# EAGLE design interface_dac_sma_feedback_3PS_LM317_parallel (EAGLE 7.2.0)
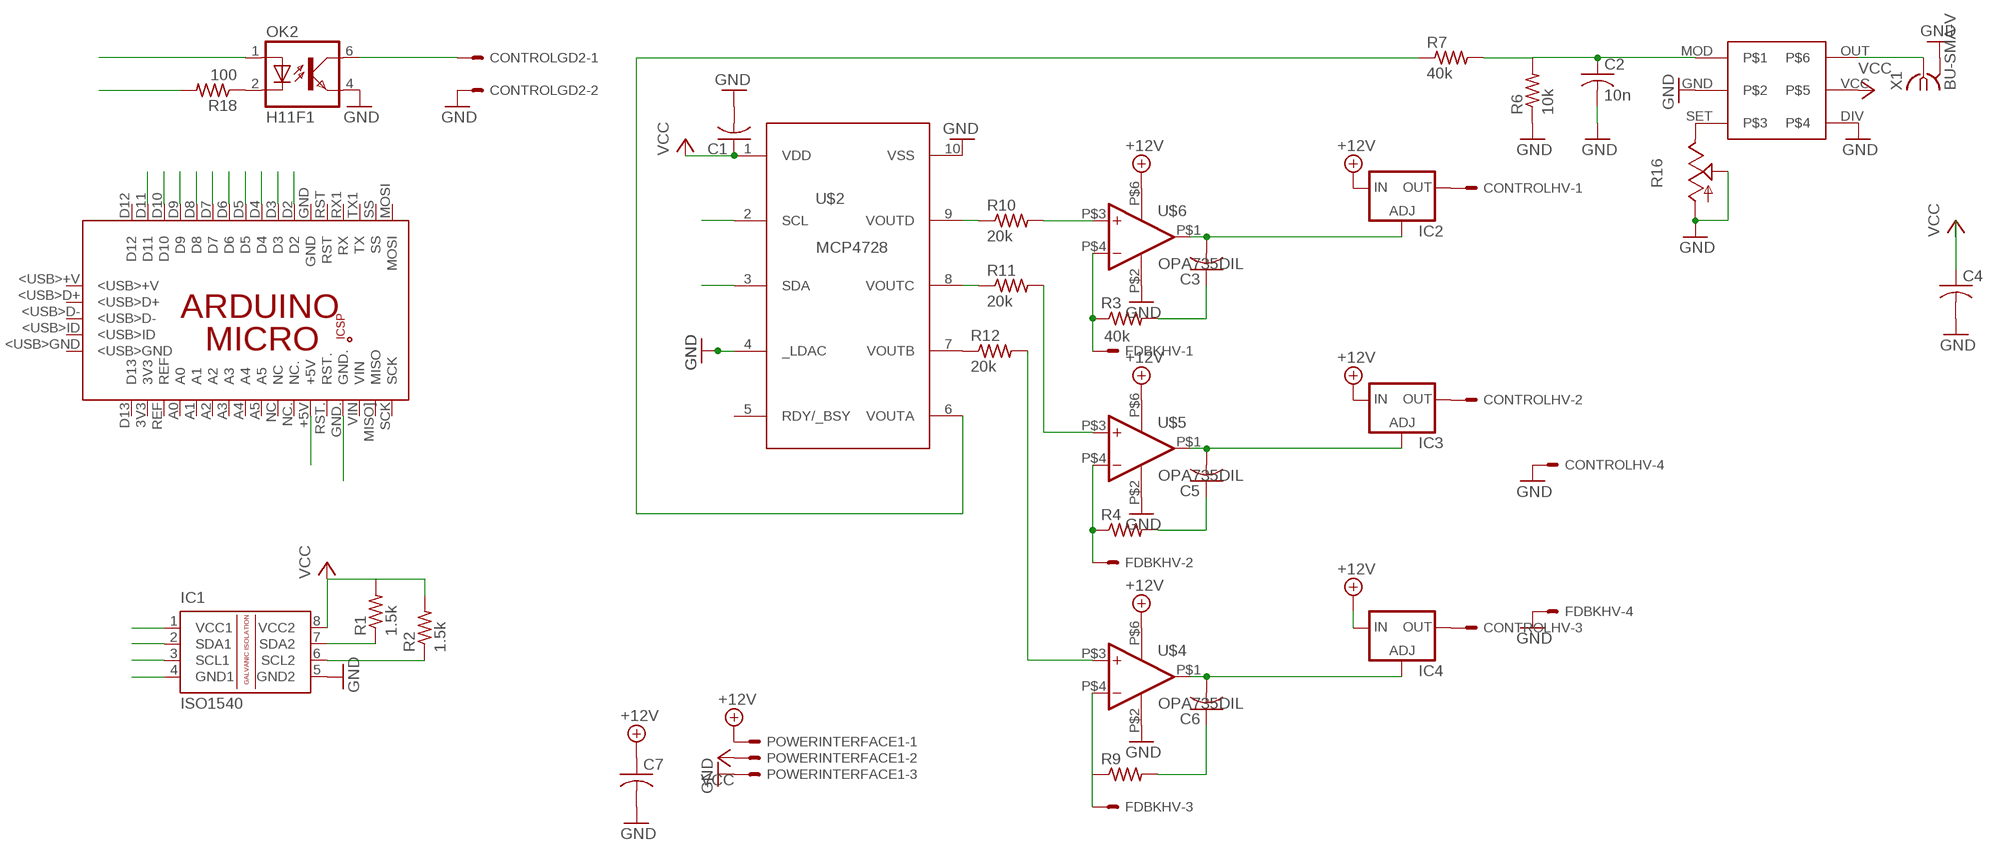
[diagram p0: schematic, sheet 1]

## Parts
C1  C-US050-050X075  [C050-050X075]
C2  10n  C-US050-024X044  [C050-024X044]
C3  C-US050-024X044  [C050-024X044]
C4  C-US075-063X106  [C075-063X106]
C5  C-US050-024X044  [C050-024X044]
C6  C-US050-024X044  [C050-024X044]
C7  C-US050-050X075  [C050-050X075]
CONTROLGD2  KK-156-2  [KK-156-2]
CONTROLHV  KK-156-4  [KK-156-4]
FDBKHV  40k  KK-156-4  [KK-156-4]
IC1  ISO1540  [DIL08]
IC2  LM317TS  [317TS]
IC3  LM317TS  [317TS]
IC4  LM317TS  [317TS]
OK2  H11F1  [DIL05]
PCB1  ARDUINO_MICRO  [ARDUINO_MICRO]
POWERINTERFACE1  KK-156-3  [KK-156-3]
R1  1.5k  R-US_0207/12  [0207/12]
R2  1.5k  R-US_0207/12  [0207/12]
R3  R-US_0207/12  [0207/12]
R4  R-US_0207/12  [0207/12]
R6  10k  R-US_0207/12  [0207/12]
R7  40k  R-US_0207/12  [0207/12]
R9  R-US_0207/12  [0207/12]
R10  20k  R-US_0207/12  [0207/12]
R11  20k  R-US_0207/12  [0207/12]
R12  20k  R-US_0207/12  [0207/12]
R16  TRIM_US-B90P  [SP19L]
R18  100  R-US_0207/12  [0207/12]
U$1  LTC6992  [DIL06]
U$2  MCP4728DIL  [DIL10]
U$4  OPA735DIL  [DIL6]
U$5  OPA735DIL  [DIL6]
U$6  OPA735DIL  [DIL6]
X1  BU-SMA-V  [BU-SMA-V]

## Nets
+12V: C7.1 IC2.3(IN) IC3.3(IN) IC4.3(IN) POWERINTERFACE1.1 U$4.P$6(V+) U$5.P$6(V+) U$6.P$6(V+)
A+5: IC1.1(VCC1) PCB1.+5V
AGND: IC1.4(GND1) PCB1.GND. R18.2
D4: PCB1.D4
D7: PCB1.D7
D8: PCB1.D8
D10: PCB1.D10
D11: PCB1.D11
ENSW2: CONTROLGD2.1 OK2.6(COL)
GND: C1.2 C2.2 C4.2 C7.2 CONTROLGD2.2 CONTROLHV.4 FDBKHV.4 IC1.5(GND2) OK2.4(EMIT) POWERINTERFACE1.3 R6.1 R16.A R16.S U$1.DIV U$1.GND U$2.4(_LDAC) U$2.10(VSS) U$4.P$2(V-) U$5.P$2(V-) U$6.P$2(V-) X1.2 X1.3 X1.4 X1.5
N$1: R7.1 U$2.6(VOUTA)
N$2: C2.1 R6.2 R7.2 U$1.MOD
N$3: C3.1 R3.2
N$4: CONTROLHV.1 IC2.2(OUT)
N$5: CONTROLHV.3 IC4.2(OUT)
N$6: FDBKHV.2 R4.1 U$5.P$4(-IN)
N$7: OK2.2(C) R18.1
N$8: FDBKHV.1 R3.1 U$6.P$4(-IN)
N$10: C5.2 IC3.1(ADJ) U$5.P$1(OUT)
N$11: CONTROLHV.2 IC3.2(OUT)
N$12: R16.E U$1.SET
N$13: U$1.OUT X1.1
N$14: FDBKHV.3 R9.1 U$4.P$4(-IN)
N$15: C5.1 R4.2
N$16: R10.2 U$6.P$3(+IN)
N$17: R11.2 U$5.P$3(+IN)
N$18: R12.2 U$4.P$3(+IN)
N$19: C3.2 IC2.1(ADJ) U$6.P$1(OUT)
N$20: C6.1 R9.2
N$21: C6.2 IC4.1(ADJ) U$4.P$1(OUT)
N$24: R10.1 U$2.9(VOUTD)
N$25: R12.1 U$2.7(VOUTB)
N$26: R11.1 U$2.8(VOUTC)
PWM5: PCB1.D5
PWM6: PCB1.D6
PWM9: OK2.1(A) PCB1.D9
SCL: IC1.3(SCL1) PCB1.D3
SCL_OUT: IC1.6(SCL2) R2.1 U$2.2(SCL)
SDA: IC1.2(SDA1) PCB1.D2
SDA_OUT: IC1.7(SDA2) R1.1 U$2.3(SDA)
VCC: C1.1 C4.1 IC1.8(VCC2) POWERINTERFACE1.2 R1.2 R2.2 U$1.VCC U$2.1(VDD)
Unconnected: PCB1.3V3 PCB1.5V PCB1.<USB>+V PCB1.<USB>D+ PCB1.<USB>D- PCB1.<USB>GND PCB1.<USB>ID PCB1.A0 PCB1.A1 PCB1.A2 PCB1.A3 PCB1.A4 PCB1.A5 PCB1.D12 PCB1.D13 PCB1.GND PCB1.GND_ PCB1.MISO. PCB1.MISO](MISO) PCB1.MOSI PCB1.MOSI. PCB1.NC PCB1.NC. PCB1.REF PCB1.RESET.. PCB1.RST PCB1.RST. PCB1.RX1(RX) PCB1.SCK PCB1.SCK. PCB1.SS PCB1.TX1(TX) PCB1.VIN U$2.5(RDY/_BSY)

## Library data of the parts
C1 = rcl:C-US: CAPACITOR, American symbol
C2-C7 = resistor:C-US: CAPACITOR, American symbol
CONTROLGD2 = con-molex:KK-156-2: KK 156 HEADER Source: http://www.molex.com/pdm_docs/sd/026604100_sd.pdf; OC_FARNELL: unknown; OC_NEWARK: unknown
CONTROLHV FDBKHV = con-molex:KK-156-4: KK 156 HEADER Source: http://www.molex.com/pdm_docs/sd/026604100_sd.pdf; OC_FARNELL: unknown; OC_NEWARK: unknown
IC1 = texas:ISO1540: ISOLATED CAN TRANSCEIVER Source: http://focus.ti.com/lit/ds/symlink/iso1050.pdf
IC2-IC4 = v-reg:LM317TS: VOLTAGE REGULATOR
OK2 = optocoupler:H11F1: OPTO COUPLER OPTO COUPLER; OC_FARNELL: unknown; OC_NEWARK: unknown
PCB1 = E14_Arduino_published:ARDUINO_MICRO: Device for representing an Arduino Micro board with a footprint in an EAGLE design. Created by Dave Young for Element14. More EAGLE documentation at: http://www.element14.com/community/community/knode/cadsoft_eagle
POWERINTERFACE1 = con-molex:KK-156-3: KK 156 HEADER Source: http://www.molex.com/pdm_docs/sd/026604100_sd.pdf; OC_FARNELL: unknown; OC_NEWARK: unknown
R1-R4 R6 R7 R9-R12 = resistor:R-US_: RESISTOR, American symbol
R16 = pot:TRIM_US-: POTENTIOMETER
R18 = rcl:R-US_: RESISTOR, American symbol
U$1 = linear-technology:LTC6992
U$2 = microchip:MCP4728
U$4-U$6 = texas:OPA735
X1 = con-coax:BU-SMA-V: FEMALE SMA CONNECTOR Radiall distributor RS 112-3794; OC_FARNELL: unknown; OC_NEWARK: unknown

## Board
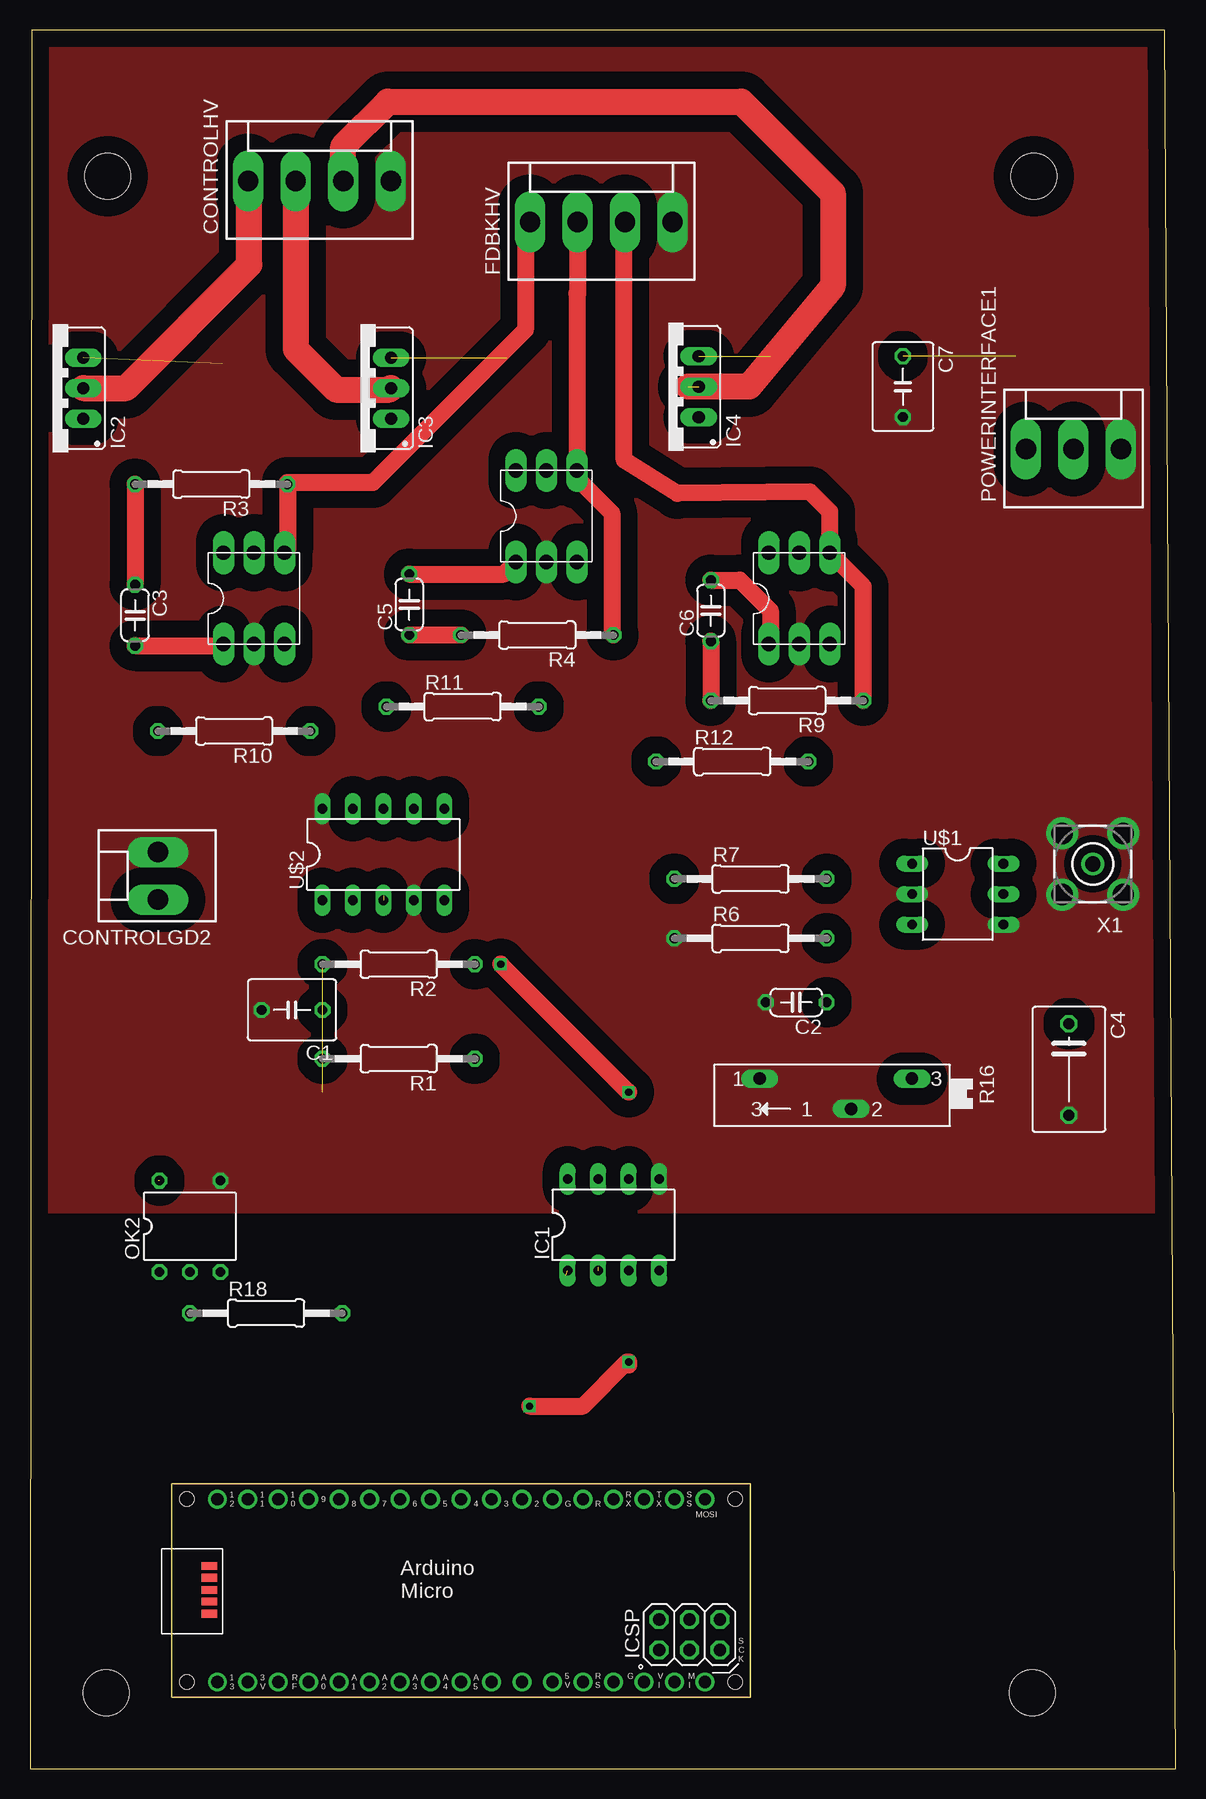
[diagram p1: board, top side]
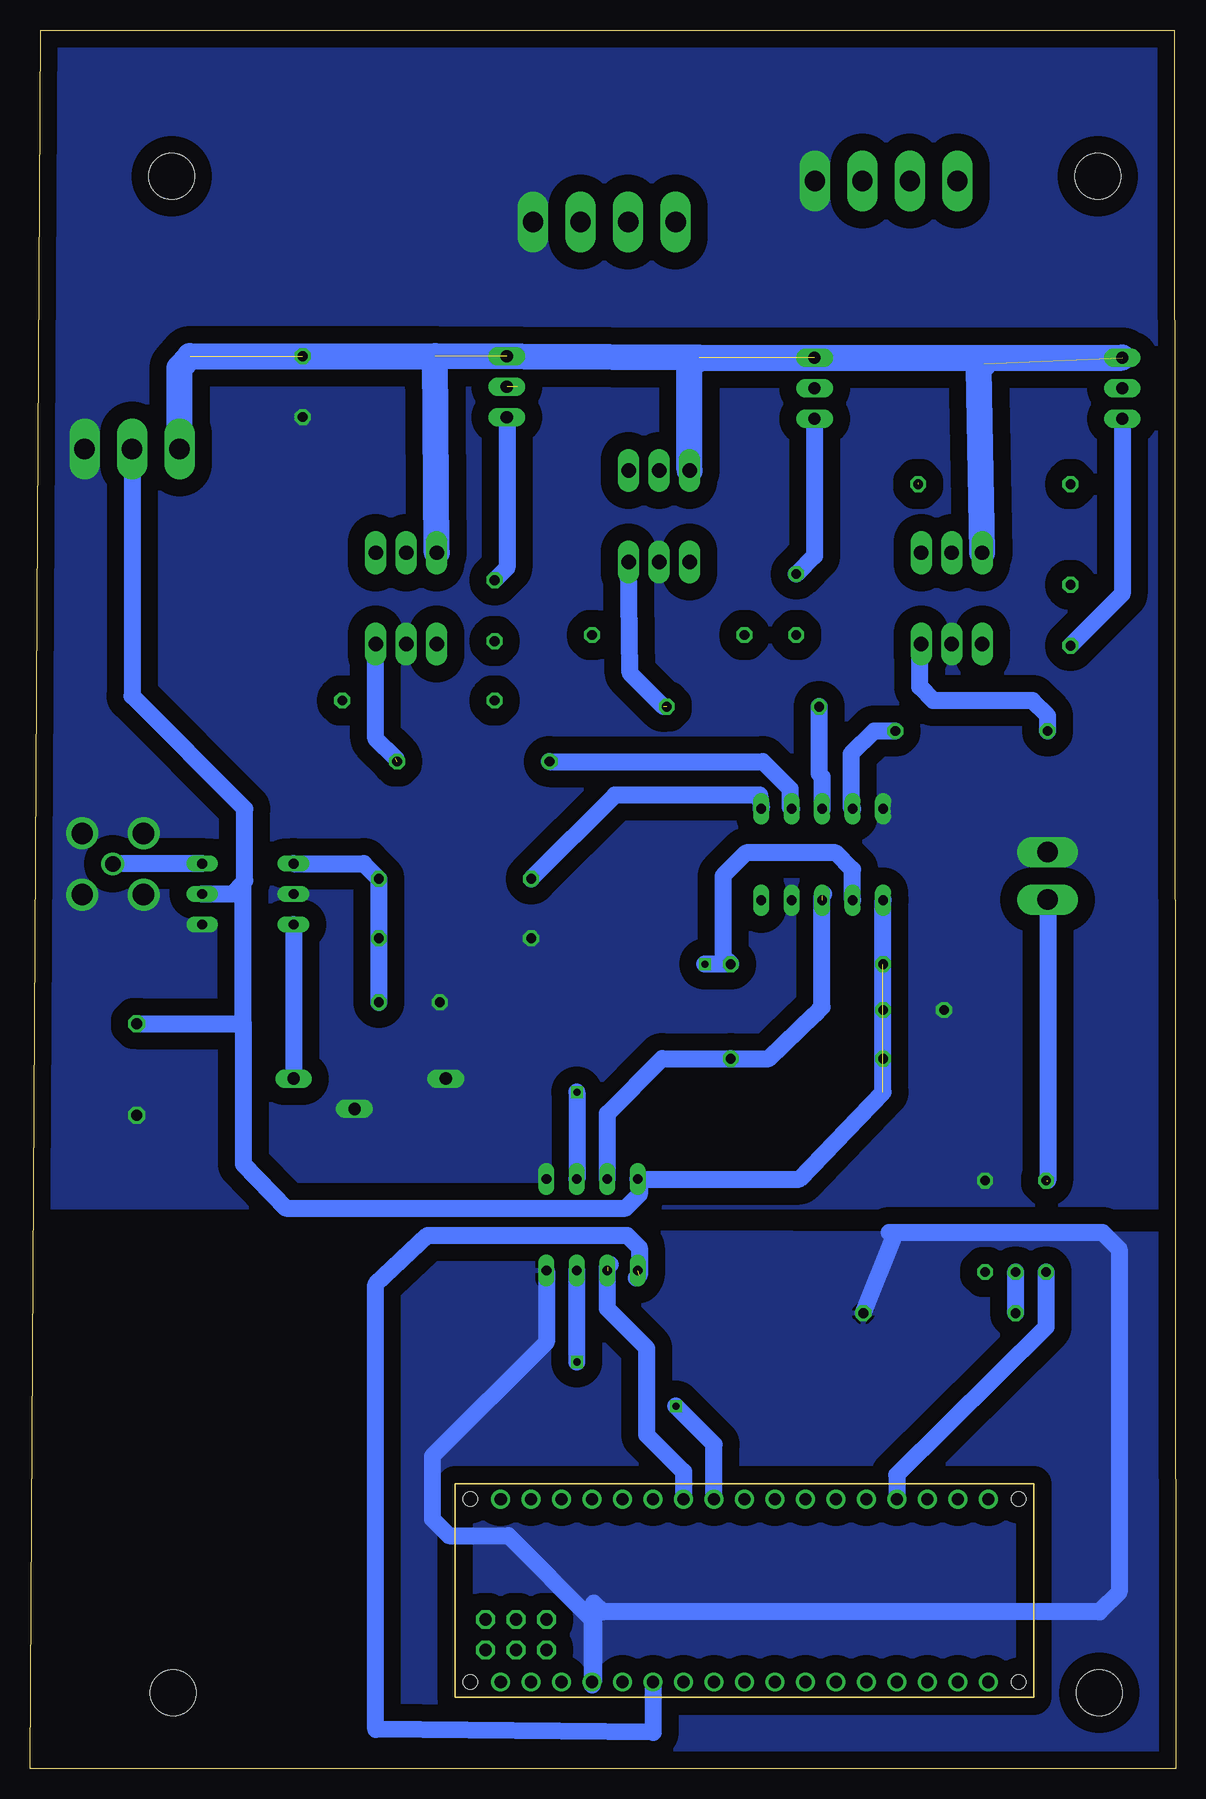
[diagram p2: board, bottom side, seen from below]

Size 95.5 x 144.91 mm. Coordinates in mm from the lower left corner, seen from the top.
Outline: 0,0 95.5,0 94.61,144.91 0.13,144.91 0,0
Copper layers (1*16): Top 0.035mm / dielectric 1.5mm / Bottom 0.035mm
Design rules "default": minimum track width 10mil, minimum drill 24mil, track to track 8mil, track to pad 8mil, pad to pad 8mil, via to via 8mil, smd to smd 8mil, copper to edge 40mil, drill to drill 8mil, minimum pad ring 10mil, minimum via ring 8mil, stop-mask expansion 4mil, vias tented up to drill 0mil, thermal gap 10mil
Holes 3.8 mm at 83.57,6.35 83.69,132.72 6.48,132.72 6.35,6.35

### Footprints (pad centres in the part's own frame; a part is rotated, then mirrored left to right if it is on the bottom)
C050-050X075 = drill 0.813 octagon: 1 -2.54,0; 2 2.54,0
C050-024X044 = drill 0.813 octagon: 1 -2.54,0; 2 2.54,0
C075-063X106 = drill 0.914 octagon: 1 -3.81,0; 2 3.81,0
KK-156-2 = drill 1.7 pad 2.184 long: 1 -1.98,0; 2 1.98,0
KK-156-4 = drill 1.7 pad 2.184 long: 1 -5.94,0; 2 -1.98,0; 3 1.98,0; 4 5.94,0
DIL08 = drill 0.813 long: 1 -3.81,-3.81; 2 -1.27,-3.81; 3 1.27,-3.81; 4 3.81,-3.81; 5 3.81,3.81; 6 1.27,3.81; 7 -1.27,3.81; 8 -3.81,3.81
317TS = drill 1.016 long: 1 -2.54,-2.54; 2 0,-2.54; 3 2.54,-2.54
DIL05 = drill 0.813 octagon: 1 -2.54,-3.81; 2 0,-3.81; 3 2.54,-3.81; 4 2.54,3.81; 6 -2.54,3.81
ARDUINO_MICRO = drill 1.016 pad 1.575: 3V3 6.35,1.27; +5V 31.75,1.27; A0 11.43,1.27; A1 13.97,1.27; A2 16.51,1.27; A3 19.05,1.27; A4 21.59,1.27; A5 24.13,1.27; D2 29.21,16.51; D3 26.67,16.51; D4 24.13,16.51; D5 21.59,16.51; D6 19.05,16.51; D7 16.51,16.51; D8 13.97,16.51; D9 11.43,16.51; D10 8.89,16.51; D11 6.35,16.51; D12 3.81,16.51; D13 3.81,1.27; GND 31.75,16.51; GND. 36.83,1.27; MISO] 41.91,1.27; MOSI 44.45,16.51; NC 26.67,1.27; NC. 29.21,1.27; REF 8.89,1.27; RST 34.29,16.51; RST. 34.29,1.27; RX1 36.83,16.51; SCK 44.45,1.27; SS 41.91,16.51; TX1 39.37,16.51; VIN 39.37,1.27 | drill 1.016 pad 1.575 octagon: 5V 40.64,6.477; GND_ 45.72,6.477; MISO. 40.64,3.937; MOSI. 43.18,6.477; RESET.. 45.72,3.937; SCK. 43.18,3.937 | smd 1.27 x 0.635: <USB>+V 3.15,10.947; <USB>D+ 3.15,9.957; <USB>D- 3.15,8.941; <USB>GND 3.15,6.96; <USB>ID 3.15,7.976 | hole 1.2: 1.27,1.27; 1.27,16.51; 46.99,16.51; 46.99,1.27
KK-156-3 = drill 1.7 pad 2.184 long: 1 -3.96,0; 2 0,0; 3 3.96,0
0207/12 = drill 0.813 octagon: 1 -6.35,0; 2 6.35,0
SP19L = drill 1.016 long: A 5.715,-1.27; E -6.985,-1.27; S -1.905,1.27
DIL06 = drill 0.813 long: DIV 2.54,3.81; GND 0,-3.81; MOD -2.54,-3.81; OUT -2.54,3.81; SET 2.54,-3.81; VCC 0,3.81
DIL10 = drill 0.813 long: 1 -5.08,-3.81; 2 -2.54,-3.81; 3 0,-3.81; 4 2.54,-3.81; 5 5.08,-3.81; 6 5.08,3.81; 7 2.54,3.81; 8 0,3.81; 9 -2.54,3.81; 10 -5.08,3.81
DIL6 = drill 1.2 long: P$1 -2.54,-3.81; P$2 0,-3.81; P$3 2.54,-3.81; P$4 2.54,3.81; P$5 0,3.81; P$6 -2.54,3.81
BU-SMA-V = drill 1.27: 1 0,0 | drill 1.778: 2 -2.55,2.55; 3 2.55,2.55; 4 2.55,-2.55; 5 -2.55,-2.55

### Placement (x,y rotation side)
C1  21.84,63.25 180 top
C2  63.88,63.88 180 top
C3  8.76,96.14 270 top
C4  86.61,58.29 270 top
C5  31.62,97.03 90 top
C6  56.77,96.52 90 top
C7  72.77,115.19 270 top
CONTROLGD2  10.67,74.42 90 top
CONTROLHV  24.13,132.33 0 top
FDBKHV  47.62,128.91 0 top
IC1  48.64,45.34 0 top
IC2  1.91,115.06 90 top
IC3  27.56,115.06 90 top
IC4  53.21,115.19 90 top
OK2  13.34,45.21 0 top
PCB1  11.81,5.97 0 top
POWERINTERFACE1  87,109.98 0 top
R1  30.73,59.18 180 top
R2  30.73,67.06 180 top
R3  15.11,107.06 180 top
R4  42.29,94.49 180 top
R6  60.07,69.22 0 top
R7  60.07,74.17 0 top
R9  63.12,89.03 180 top
R10  17.02,86.49 180 top
R11  36.07,88.52 0 top
R12  58.55,83.95 0 top
R16  66.55,56.26 180 top
R18  19.68,37.97 0 top
U$1  77.34,72.9 270 top
U$2  29.46,76.2 0 top
U$4  64.14,97.54 0 top
U$5  43.05,104.39 0 top
U$6  18.67,97.54 0 top
X1  88.6,75.41 180 top

### Tracks (layer width: path | path; a pad name or v marks a point on that pad's centre or on a via)
+12V  (4 unrouted)
  Bottom 2.184: 39.75,117.6 61.72,117.73 | U$4.P$6 61.72,117.73 | U$5.P$6 40.51,116.84 39.75,117.6 | U$6.P$6 16.38,116.71 16,117.09 | 39.75,117.6 IC2.3 | POWERINTERFACE1.1 83.03,116.74 82.17,117.73 61.72,117.73
A+5  (1 unrouted)
  Bottom 1.422: PCB1.+5V 43.56,3.05 66.67,3.3 66.67,40.39 62.36,44.45 45.72,44.45 44.7,43.43 44.7,41.15 44.96,40.89
AGND
  Bottom 1.422: IC1.4 52.45,35.56 61.98,26.04 61.98,20.83 60.58,19.43 55.63,19.43 48.64,12.45 PCB1.GND. | PCB1.GND. 48.64,6.99 | R18.2 23.5,44.32 23.88,44.7 6.1,44.7 4.7,43.31 4.7,14.73 6.35,13.08 47.75,13.08 48.51,13.84 48.51,7.37 PCB1.GND.
  pour Bottom (isolate 1.422): -0.13,0.13 95.76,0.25 95.76,44.83 0,44.58
ENSW2  (1 unrouted)
  Bottom 1.422: CONTROLGD2.1 10.67,49.02
GND
  pour Bottom (isolate 1.422, no thermals): 0.13,144.65 94.74,144.53 95.5,46.86 0,46.86
  pour Top (isolate 1.422, no thermals): 0.13,144.78 95.76,144.78 95.63,46.48 0,46.48
N$1
  Bottom 1.422: U$2.6 34.67,81.15 46.74,81.15 R7.1
N$2
  Bottom 1.422: U$1.MOD 67.69,75.44 R7.2 R6.2 C2.1
N$3
  Top 1.422: R3.2 C3.1
N$4
  Top 2.184: IC2.2 8,115.06 18.29,125.35 18.29,132.24 CONTROLHV.1
N$5  (1 unrouted)
  Top 2.184: CONTROLHV.3 26.11,135.2 29.84,138.94 59.31,138.94 66.93,131.32 66.93,123.57 59.94,115.19 54.86,115.19
N$6
  Top 1.422: FDBKHV.2 45.65,122.76 45.59,122.94 U$5.P$4 45.59,107.57 48.51,104.65 48.51,94.61 R4.1
N$7
  Bottom 1.422: R18.1 OK2.2
N$8  (1 unrouted)
  Top 1.422: FDBKHV.1 41.3,128.78 41.3,119.92 28.57,107.19 21.46,107.19 21.46,101.6 U$6.P$4
N$10
  Top 1.422: C5.2 39.5,99.57 U$5.P$1
  Bottom 1.422: IC3.1 30.1,101.09 C5.2
N$11
  Top 2.184: CONTROLHV.2 22.15,118.31 25.53,114.94 29.97,114.94 IC3.2
N$12
  Bottom 1.422: U$1.SET R16.E
N$13
  Bottom 1.422: U$1.OUT 88.32,75.44 X1.1
N$14
  Top 1.422: R9.1 69.47,98.55 U$4.P$4 66.67,104.78 65.02,106.43 53.98,106.3 49.53,109.09 49.53,128.19 FDBKHV.3
N$15
  Top 1.422: R4.2 C5.1
N$16
  Bottom 1.422: R10.2 10.67,87.76 11.94,89.03 20.19,89.03 21.34,90.17 21.34,93.6 U$6.P$3
N$17  (1 unrouted)
  Bottom 1.422: 42.67,88.52 45.47,91.31 U$5.P$3
N$18  (1 unrouted)
  Bottom 1.422: 65.02,84.2 66.67,85.85 U$4.P$3
N$19
  Top 1.422: C3.2 16,93.6 U$6.P$1
  Bottom 1.422: IC2.1 4.45,97.92 C3.2
N$20
  Top 1.422: C6.1 R9.2
N$21
  Top 1.422: C6.2 59.18,99.06 61.72,96.52 61.72,93.85 U$4.P$1
  Bottom 1.422: IC4.1 55.75,100.08 C6.2
N$24
  Bottom 1.422: R10.1 25.15,86.49 27.05,84.58 27.05,80.14 U$2.9
N$25
  Bottom 1.422: R12.1 34.42,83.95 32.13,81.66 32.13,80.14 U$2.7
N$26
  Bottom 1.422: R11.1 29.72,82.93 29.46,82.68 U$2.8
PWM9
  Bottom 1.422: PCB1.D9 23.24,24.51 10.79,36.83 OK2.1
SCL  (via drill 0.6)
  Top 1.422: v41.66,30.23 46.1,30.23 49.78,33.91 49.91,33.66 v49.91,33.91
  Bottom 1.422: PCB1.D3 38.48,27.05 v41.66,30.23 | v49.91,33.91 IC1.3
SCL_OUT  (via drill 0.6)
  Top 1.422: v39.24,67.06 v49.91,56.39
  Bottom 1.422: U$2.2 26.92,74.93 28.32,76.33 35.81,76.33 37.72,74.42 37.72,67.69 R2.1 v39.24,67.06 | v49.91,56.39 IC1.6
SDA  (1 unrouted)
  Bottom 1.422: PCB1.D2 41.02,24.77 44.07,27.81 44.07,35.05 47.37,38.35 47.37,41.78 47.12,42.04
SDA_OUT  (1 unrouted)
  Bottom 1.422: IC1.7 47.37,54.61 42.8,59.18 R1.1 33.91,59.18 30.1,62.87 29.46,63.5 29.46,72.77 29.34,72.9
VCC  (3 unrouted)
  Bottom 1.422: 77.72,73.79 77.6,74.04 77.6,80.01 87,89.41 POWERINTERFACE1.2 | 77.72,73.79 78.61,72.9 U$1.VCC | C4.1 77.72,62.1 | 77.72,62.1 77.72,73.79 | U$2.1 24.38,56.39 31.37,49.15 IC1.8 44.7,49.02 44.7,47.88 45.85,46.74 74.17,46.74 77.72,50.42 77.72,62.1